# Altium schematic sheet Lab10.SCHDOC
size 420 x 297 mm; SheetNumber: 1; SheetTotal: 1; DocumentName: Sheet1.SCHDOC
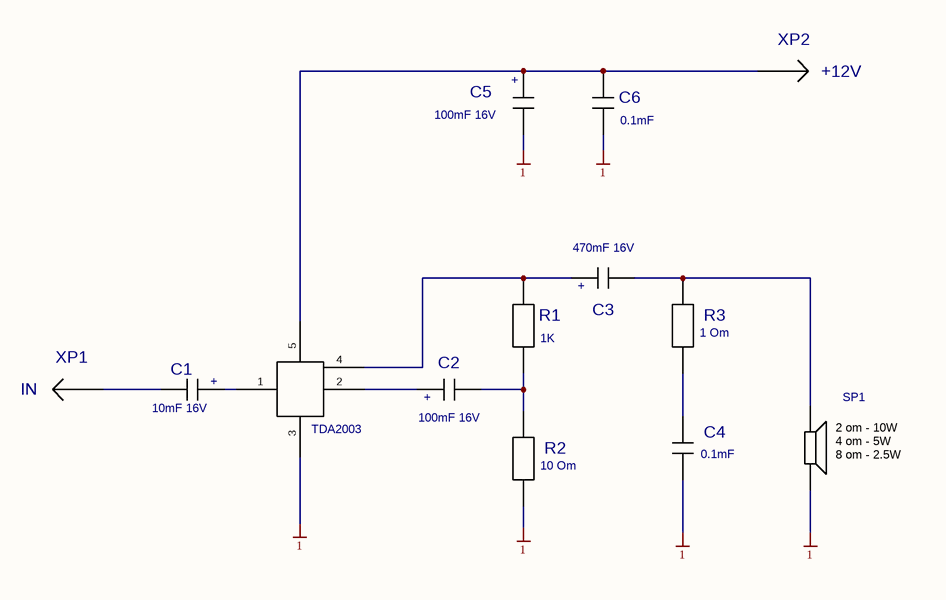
[diagram p0: Lab10.SCHDOC]

## Parts
1  TDA2003  [TDA2003]
C1  value 10mF 16V  [CAP2]  (hidden comment: CAP2)
C2  value 100mF 16V  [CAP2]  (hidden comment: CAP2)
C3  value 470mF 16V  [CAP2]  (hidden comment: CAP2)
C4  value 0.1mF  [CAP1]  (hidden comment: CAP1)
C5  value 100mF 16V  [CAP2]  (hidden comment: CAP2)
C6  value 0.1mF  [CAP1]  (hidden comment: CAP1)
R1  value 1K  [RES]  (hidden comment: RES)
R2  value 10 Om  [RES]  (hidden comment: RES)
R3  value 1 Om  [RES]  (hidden comment: RES)
SP1  SPEAKER  [CAP1]  (value not drawn)
XP1  value IN  [1PAD]  (hidden comment: XP1)
XP2  value +12V  [1PAD]  (hidden comment: XP1)

## Nets
1: 1.3 C4.1 C5.2 C6.1 R2.1 SP1.2
Net1_1: 1.1 C1.1
Net1_2: 1.2 C2.1
Net1_4: 1.4 C3.1 R1.2
Net1_5: 1.5 C5.1 C6.2 XP2.1(A1)
NetC1_2: C1.2 XP1.1(A1)
NetC2_2: C2.2 R1.1 R2.2
NetC3_2: C3.2 R3.2 SP1.1
NetC4_2: C4.2 R3.1

## Notes on the sheet
- (near SP1) 2 om - 10W
  4 om - 5W
  8 om - 2.5W
- (in symbol CAP2) +

## Library data of the parts
1 = TDA2003: Value: *
SP1 = SPEAKER: Value: *